# Altium project EV_Charger.PrjPcb
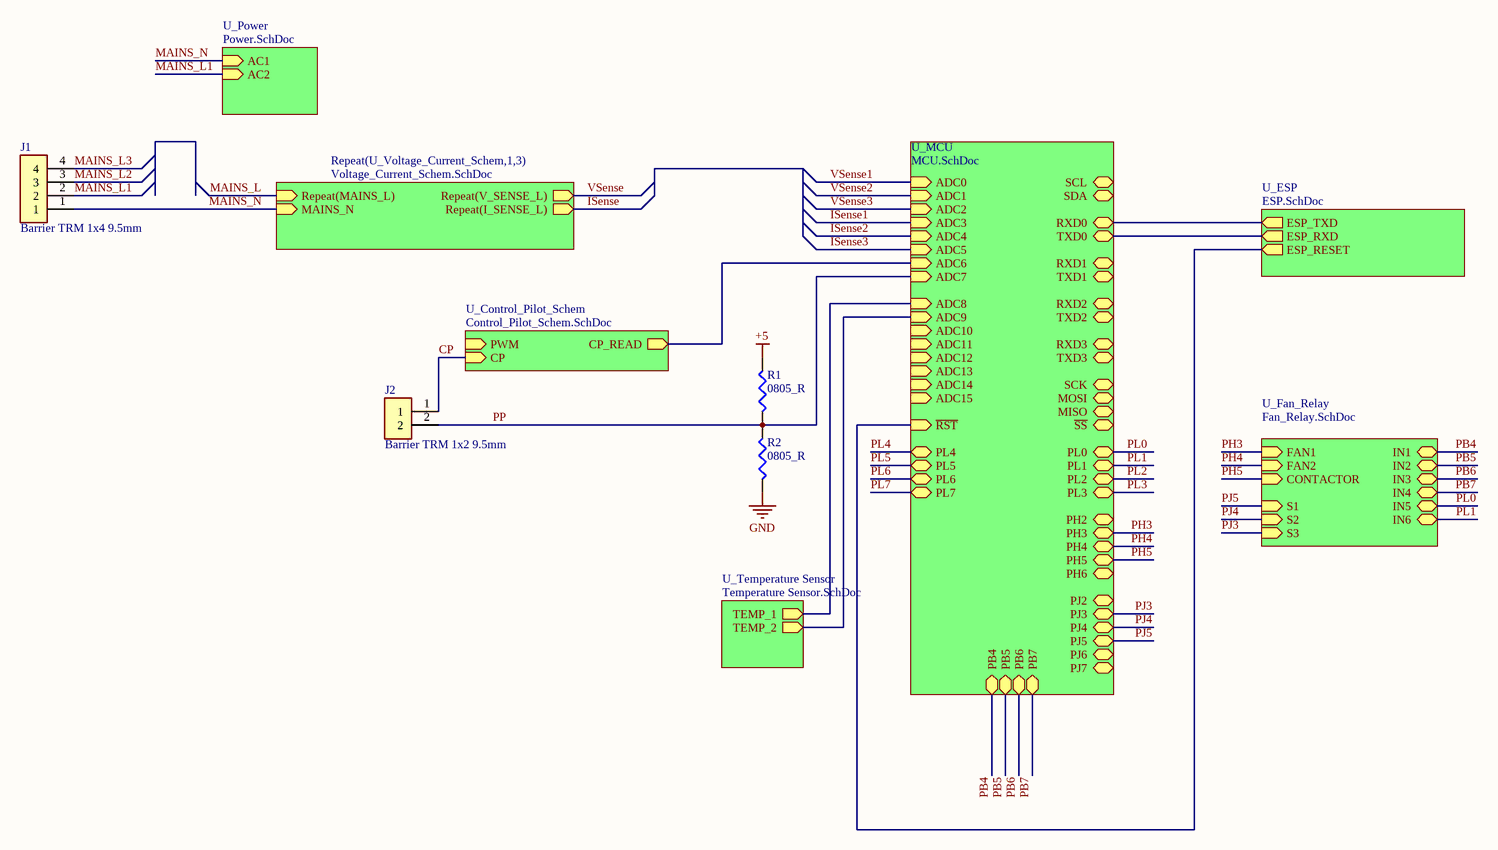
[diagram p0: EV_Schematics.SchDoc]
8 sheets, 198 parts. Net scope: hierarchical (ports join the sheet entries above them; power ports are global).
Board file: EV_PCB.PcbDoc
Sheets:
  EV_Schematics.SchDoc
    U_Control_Pilot_Schem = Control_Pilot_Schem.SchDoc
    U_ESP = ESP.SchDoc
    U_Fan_Relay = Fan_Relay.SchDoc
    U_MCU = MCU.SchDoc
    U_Power = Power.SchDoc
    U_Temperature Sensor = Temperature Sensor.SchDoc
    U_Voltage_Current_Schem1 = Voltage_Current_Schem.SchDoc
    U_Voltage_Current_Schem2 = Voltage_Current_Schem.SchDoc
    U_Voltage_Current_Schem3 = Voltage_Current_Schem.SchDoc

## Sheet EV_Schematics.SchDoc
size A3; SheetNumber: 1; SheetTotal: 8

### Parts
J1  Barrier TRM 1x4 9.5mm  [BARRIER_4_9.5mm]
J2  Barrier TRM 1x2 9.5mm  [BARRIER_9.5MM]
R1  0805_R  [R0805]
R2  0805_R  [R0805]

### Sub-sheets
Repeat(U_Voltage_Current_Schem,1,3) = Voltage_Current_Schem.SchDoc: Repeat(MAINS_L) (in), MAINS_N (in), Repeat(V_SENSE_L) (out), Repeat(I_SENSE_L) (out)
U_Control_Pilot_Schem = Control_Pilot_Schem.SchDoc: PWM (in), CP_READ (out), CP (in)
U_ESP = ESP.SchDoc: ESP_TXD (out), ESP_RXD (out), ESP_RESET (out)
U_Fan_Relay = Fan_Relay.SchDoc: FAN1 (in), FAN2 (in), S1 (in), S2 (in), S3 (in), IN1 (bidir), IN2 (bidir), IN3 (bidir), IN4 (bidir), IN5 (bidir), IN6 (bidir), CONTACTOR (in)
U_MCU = MCU.SchDoc: SCL (bidir), ADC1 (in), ADC2 (in), ADC3 (in), ADC4 (in), ADC5 (in), ADC6 (in), ADC7 (in), ADC0 (in), ~{RST} (in), SDA (bidir), RXD1 (bidir), TXD1 (bidir), RXD0 (bidir), TXD0 (bidir), ~{SS} (bidir), SCK (bidir), MOSI (bidir), MISO (bidir), ADC9 (in), ADC10 (in), ADC11 (in), ADC12 (in), ADC13 (in), ADC14 (in), ADC15 (in), ADC8 (in), RXD3 (bidir), TXD3 (bidir), RXD2 (bidir), TXD2 (bidir), PL0 (bidir), PL1 (bidir), PL2 (bidir), PL3 (bidir), PL4 (bidir), PL5 (bidir), PL6 (bidir), PL7 (bidir), PB4 (bidir), PB7 (bidir), PB5 (bidir), PB6 (bidir), PH4 (bidir), PH2 (bidir), PH5 (bidir), PH6 (bidir), PH3 (bidir), PJ4 (bidir), PJ7 (bidir), PJ5 (bidir), PJ3 (bidir), PJ2 (bidir), PJ6 (bidir)
U_Power = Power.SchDoc: AC1 (in), AC2 (in)
U_Temperature Sensor = Temperature Sensor.SchDoc: TEMP_1 (out), TEMP_2 (out)

### Nets
+5: R1.2 ; sheet U_ESP/ESP_RESET, sheet U_MCU/~{RST}  [project net ~{RST}]
GND: R2.1
ADC6: sheet U_Control_Pilot_Schem/CP_READ, sheet U_MCU/ADC6
ADC8: sheet U_MCU/ADC8, sheet U_Temperature Sensor/TEMP_1
ADC9: sheet U_MCU/ADC9, sheet U_Temperature Sensor/TEMP_2
CP: J2.1 ; sheet U_Control_Pilot_Schem/CP
ISense: sheet Repeat(U_Voltage_Current_Schem,1,3)/Repeat(I_SENSE_L)
MAINS_L: sheet Repeat(U_Voltage_Current_Schem,1,3)/Repeat(MAINS_L)
MAINS_L1: J1.2 ; sheet U_Power/AC2
MAINS_L2: J1.3
MAINS_L3: J1.4
MAINS_N: J1.1 ; sheet U_Power/AC1, sheet Repeat(U_Voltage_Current_Schem,1,3)/MAINS_N
PB4: sheet U_Fan_Relay/IN1, sheet U_MCU/PB4
PB5: sheet U_Fan_Relay/IN2, sheet U_MCU/PB5
PB6: sheet U_Fan_Relay/IN3, sheet U_MCU/PB6
PB7: sheet U_Fan_Relay/IN4, sheet U_MCU/PB7
PH3: sheet U_Fan_Relay/FAN1, sheet U_MCU/PH3
PH4: sheet U_Fan_Relay/FAN2, sheet U_MCU/PH4
PH5: sheet U_Fan_Relay/CONTACTOR, sheet U_MCU/PH5
PJ3: sheet U_Fan_Relay/S3, sheet U_MCU/PJ3
PJ4: sheet U_Fan_Relay/S2, sheet U_MCU/PJ4
PJ5: sheet U_Fan_Relay/S1, sheet U_MCU/PJ5
PL0: sheet U_Fan_Relay/IN5, sheet U_MCU/PL0
PL1: sheet U_Fan_Relay/IN6, sheet U_MCU/PL1
PP: J2.2 R1.1 R2.2 ; sheet U_MCU/ADC7  [project net ADC7]
RXD0: sheet U_ESP/ESP_TXD, sheet U_MCU/RXD0
TXD0: sheet U_ESP/ESP_RXD, sheet U_MCU/TXD0
VSense: sheet Repeat(U_Voltage_Current_Schem,1,3)/Repeat(V_SENSE_L)

### Library data of the parts
J1 = Barrier BLK_4: CONN BARRIER STRIP 4CIRC 0.374"; Manufacturer 1: On-Shore Technology; Manufacturer Part Number 1: OSTYK44102030; Current Rating: 30A; Voltage Rating: 300V; Parameter Name 1: Bulk; Number of Circuits: 2; Wire Gauge (Max): 22AWG; Wire Gauge (Min): 10AWG; Pitch: 0.374inch; Supplier 1: Digi-Key; Stock 1: 3505; Pricing 1: 1=1.22000, 10=0.76100, 25=0.65160, 50=0.58560, 100=0.57340, 250=0.48800, 500=0.46360, 1000=0.41480, 5000=0.32452 (USD); RoHS: Yes; Mount: Through Hole; Color: Black; Insulation Material: Nylon; Min Operating Temperature: -40°C; Max Operating Temperature: 105°C; Number of Rows: 1; Number of Wire Entries: 2; Flammability Rating: UL94 V-0; ComponentLink1URL: https://datasheet.ciiva.com/778/ostyk441xx030-778584.pdf?src-supplier=Digi-Key; ComponentLink1Description: https://datasheet.ciiva.com/778/ostyk441xx030-778584.pdf?src-supplier=Digi-Key; Supplier Part Number 1: ED2971-ND
J2 = Barrier BLK: CONN BARRIER STRIP 2CIRC 0.374"; Manufacturer 1: On-Shore Technology; Manufacturer Part Number 1: OSTYK44102030; Current Rating: 30A; Voltage Rating: 300V; Parameter Name 1: Bulk; Number of Circuits: 2; Wire Gauge (Max): 22AWG; Wire Gauge (Min): 10AWG; Pitch: 0.374inch; Supplier 1: Digi-Key; Stock 1: 3505; Pricing 1: 1=1.22000, 10=0.76100, 25=0.65160, 50=0.58560, 100=0.57340, 250=0.48800, 500=0.46360, 1000=0.41480, 5000=0.32452 (USD); RoHS: Yes; Mount: Through Hole; Color: Black; Insulation Material: Nylon; Min Operating Temperature: -40°C; Max Operating Temperature: 105°C; Number of Rows: 1; Number of Wire Entries: 2; Flammability Rating: UL94 V-0; ComponentLink1URL: https://datasheet.ciiva.com/778/ostyk441xx030-778584.pdf?src-supplier=Digi-Key; ComponentLink1Description: https://datasheet.ciiva.com/778/ostyk441xx030-778584.pdf?src-supplier=Digi-Key; Supplier Part Number 1: ED2971-ND
R1 R2 = 0805 Resistor

## Sheet Control_Pilot_Schem.SchDoc
size A; SheetNumber: 4; SheetTotal: 8
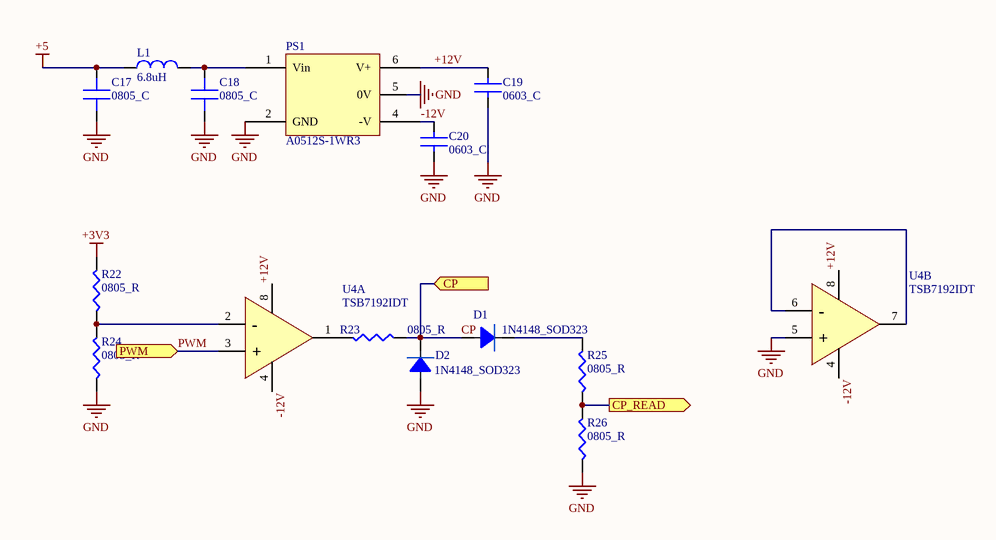
[diagram p1: Control_Pilot_Schem.SchDoc]

### Parts
C17  0805_C  [C0805 - 0.1uf]
C18  0805_C  [C0805 - 0.1uf]
C19  0603_C  [0603_CAP]
C20  0603_C  [0603_CAP]
D1  1N4148_SOD323  [SOD-323]
D2  1N4148_SOD323  [SOD-323]
L1  6.8uH  [R0805]
PS1  A0512S-1WR3  [CONV_RB-0512D/HP]
R22  0805_R  [R0805]
R23  0805_R  [R0805]
R24  0805_R  [R0805]
R25  0805_R  [R0805]
R26  0805_R  [R0805]
U4  TSB7192IDT  [SOP8]  (parts A,B of 2)

### Ports
CP (in), CP_READ (out), PWM (in)

### Nets
+3V3: R22.2
+5: C17.2 L1.1  [project net ~{RST}]
GND: C17.1 C18.1 C19.2 C20.2 D2.A(Anode) PS1.2(GND) PS1.5(0V) R24.1 R26.1 U4.5(+)
+12V: C19.1 PS1.6(V+) U4.8(VCC)
-12V: C20.1 PS1.4(-V) U4.4(VSS)
ADC6: R25.1 R26.2 ; port CP_READ
CP: D1.A(Anode) D2.K(Cathode) R23.1 ; port CP
PWM: U4.3(+) ; port PWM
NetC18_2: C18.2 L1.2 PS1.1(Vin)
NetD1_K: D1.K(Cathode) R25.2
NetR22_1: R22.1 R24.2 U4.2(-)
NetR23_2: R23.2 U4.1(OUT1)
NetU4_6: U4.6(-) U4.7(OUT1)

### Library data of the parts
C17 C18 = 0805 Capacitor
C19 C20 = 0603 Capacitor
D1 D2 = 1N4148WS: DIODE GEN PURP 100V 300MA SOD123; Reverse Recovery Time: 4ns; Forward Voltage: 1.25V; Element Configuration: Single; Forward Current: 150mA; Peak Non-Repetitive Surge Current: 2A; Max Reverse Current: 1uA; Power Dissipation: 400mW; Polarity: Standard; Capacitance: 2pF; Voltage Rating (DC): 75V; Supplier 1: Digi-Key; Stock 1: 0; Pricing 1: 1=0.18000, 10=0.16800, 100=0.09120, 500=0.05614, 1000=0.03828 (USD); RoHS: Yes; Mount: Surface Mount; Number of Pins: 2; Weight: 0.000353oz; Contact Plating: Tin,Matte; Min Operating Temperature: -65°C; Max Operating Temperature: 150°C; Packaging: Tape and Reel; Max Repetitive Reverse Voltage (Vrrm): 100V; Average Rectified Current: 300mA; Max Reverse Voltage (DC): 100V; Package Quantity: 3000; Recovery Time: 4ns; Max Forward Surge Current (Ifsm): 2A; Current Rating: 150mA; Max Surge Current: 2A; Output Current: 150mA; Series: -; Voltage: 100V; Reverse Recovery Time-Max: 4ns; Power Rating: 400mW; Length: 2.85mm; Width: 1.7mm; Height: 1.25mm; Radiation Hardening: No; Lead Free: Lead Free; RoHS Compliant: Yes; REACH SVHC: No SVHC; ComponentLink1URL: https://datasheet.ciiva.com/911/ds30086-911734.pdf?src-supplier=Digi-Key; ComponentLink1Description: https://datasheet.ciiva.com/911/ds30086-911734.pdf?src-supplier=Digi-Key; ComponentLink2URL: https://datasheet.ciiva.com/911/ds30086-911735.pdf?src-supplier=Digi-Key; ComponentLink2Description: https://datasheet.ciiva.com/911/ds30086-911735.pdf?src-supplier=Digi-Key; ComponentLink3URL: https://datasheet.ciiva.com/22695/1915529-22695239.pdf?src-supplier=Element14; ComponentLink3Description: https://datasheet.ciiva.com/22695/1915529-22695239.pdf?src-supplier=Element14; ComponentLink4URL: https://datasheet.ciiva.com/911/ds30086-911736.pdf?src-supplier=Digi-Key; ComponentLink4Description: https://datasheet.ciiva.com/911/ds30086-911736.pdf?src-supplier=Digi-Key; ComponentLink5URL: https://datasheet.ciiva.com/1179/1915529-1179304.pdf?src-supplier=Element14; ComponentLink5Description: https://datasheet.ciiva.com/1179/1915529-1179304.pdf?src-supplier=Element14; ComponentLink6URL: https://datasheet.ciiva.com/4435/ds30086-4435128.pdf?src-supplier=Mouser; ComponentLink6Description: https://datasheet.ciiva.com/4435/ds30086-4435128.pdf?src-supplier=Mouser; ComponentLink7URL: https://datasheet.ciiva.com/8300/ds30086-8300392.pdf?src-supplier=Avnet; ComponentLink7Description: https://datasheet.ciiva.com/8300/ds30086-8300392.pdf?src-supplier=Avnet; ComponentLink8URL: https://datasheet.ciiva.com/25919/ds30086-25919609.pdf?src-supplier=Avnet+Europe; ComponentLink8Description: https://datasheet.ciiva.com/25919/ds30086-25919609.pdf?src-supplier=Avnet+Europe; ComponentLink9URL: https://datasheet.ciiva.com/15219/getdatasheetpartid-110030-15219548.pdf?src-supplier=Verical; ComponentLink9Description: https://datasheet.ciiva.com/15219/getdatasheetpartid-110030-15219548.pdf?src-supplier=Verical; ComponentLink10URL: https://datasheet.ciiva.com/8303/ds30086-8303197.pdf?src-supplier=Avnet; ComponentLink10Description: https://datasheet.ciiva.com/8303/ds30086-8303197.pdf?src-supplier=Avnet
L1 = ILSB1206ER100K: 6.8uH 0805 Inductor; Manufacturer 1: Vishay Dale; Core Material: Ferrite; Current Rating: 25mA; Tolerance: 10%; Shielding: Shielded; Self Resonant Frequency: 28MHz; Q Factor: 45; Inductance: 10uH; DC Resistance (DCR): 1R; Test Frequency: 2MHz; Supplier 1: Mouser; Stock 1: 11113; Pricing 1: 1=0.23, 10=0.204, 50=0.204, 100=0.137, 1000=0.096, 10000=0.072 (USD); RoHS: Yes; Mount: Surface Mount; Case/Package: 1206; Case Code (Metric): 3216; Case Code (Imperial): 1206; Min Operating Temperature: -55°C; Max Operating Temperature: 125°C; Package Quantity: 3000; Packaging: Tape and Reel; Inductance Tolerance: 10%; Max DC Current: 25mA; Termination: SMD/SMT; DC Current: 25mA; Series: ILSB-1206; Rated Current-Max: 25mA; Length: 0.126inch; Width: 0.063inch; Height: 0.02inch; Height - Seated (Max): 0.055inch; Depth: 1.8mm; Radiation Hardening: No; Military Standard: Not; Lead Free: Lead Free; RoHS Compliant: Yes; Reach SVHC Compliant: Unknown; ComponentLink1URL: https://datasheet.ciiva.com/1067/ilsb1206-1067856.pdf?src-supplier=Digi-Key; ComponentLink1Description: https://datasheet.ciiva.com/1067/ilsb1206-1067856.pdf?src-supplier=Digi-Key; ComponentLink2URL: https://datasheet.ciiva.com/7243/1537078-7243341.pdf?src-supplier=Newark; ComponentLink2Description: https://datasheet.ciiva.com/7243/1537078-7243341.pdf?src-supplier=Newark; ComponentLink3URL: https://datasheet.ciiva.com/3867/ilsb1206-3867119.pdf?src-supplier=Arrow+Electronics; ComponentLink3Description: https://datasheet.ciiva.com/3867/ilsb1206-3867119.pdf?src-supplier=Arrow+Electronics; Supplier Part Number 1: 70-ILSB1206ER100K; Manufacturer Part Number 1: ILSB1206ER100K
R22-R26 = 0805 Resistor
U4 = TSB7192IDT: 22MHz 300nA Dual channel SOIC-8 Precision Op Amps ROHS

## Sheet ESP.SchDoc
size A; SheetNumber: 6; SheetTotal: 8
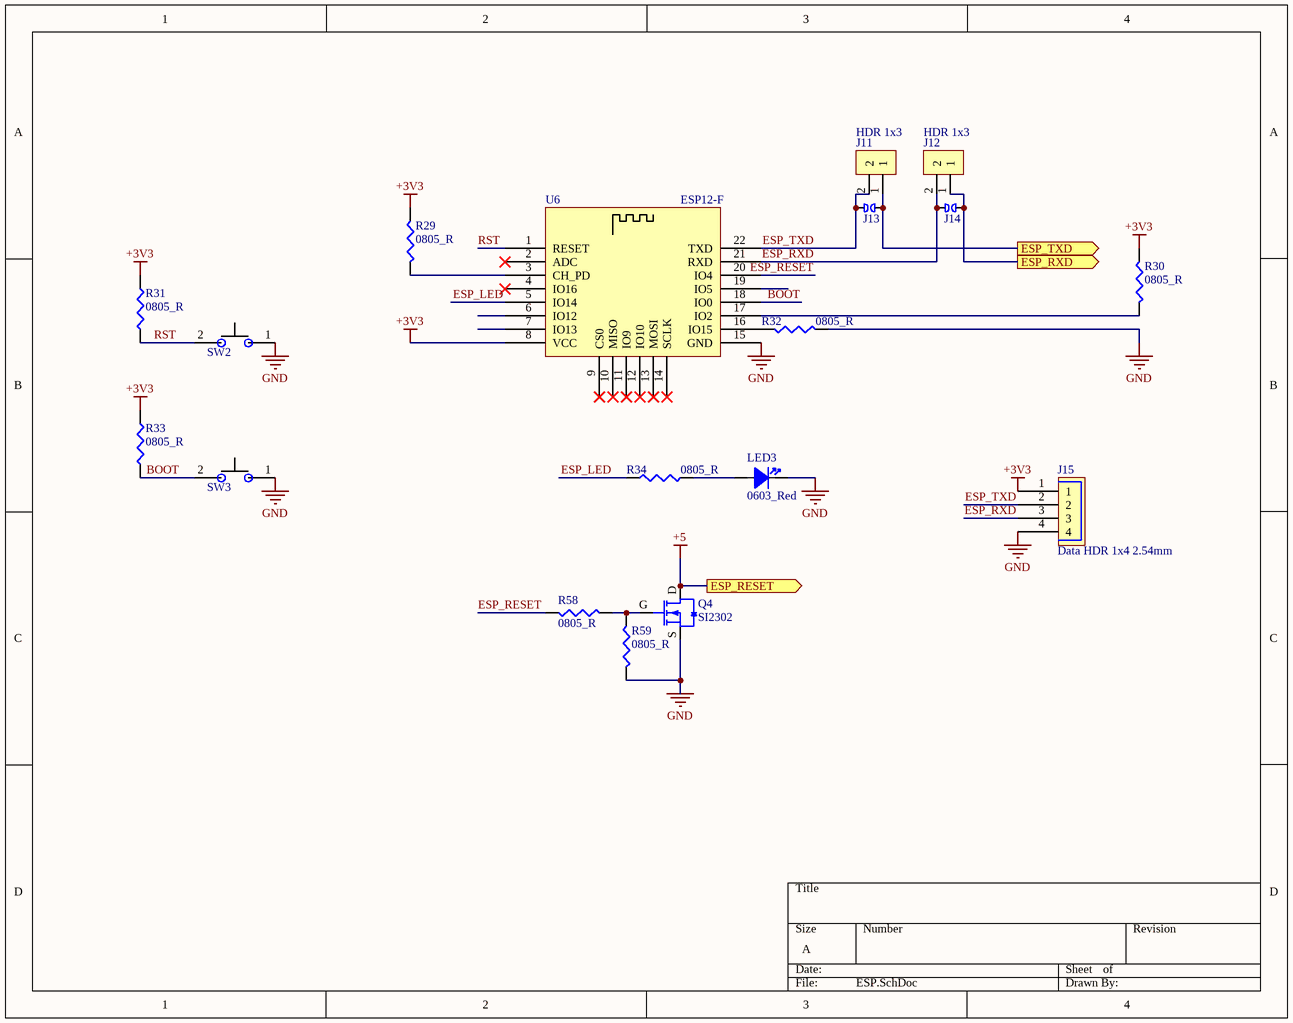
[diagram p2: ESP.SchDoc]

### Parts
J11  HDR 1x3  [HDR 1x2 2.54mm]
J12  HDR 1x3  [HDR 1x2 2.54mm]
J13  Jumper Pads  [JMP]  (value not drawn)
J14  Jumper Pads  [JMP]  (value not drawn)
J15  Data HDR 1x4 2.54mm  [DHDR_1x4_2.54mm]
LED3  0603_Red  [0603_LED]
Q4  SI2302  [SO-23 - MOSFET]
R29  0805_R  [R0805]
R30  0805_R  [R0805]
R31  0805_R  [R0805]
R32  0805_R  [R0805]
R33  0805_R  [R0805]
R34  0805_R  [R0805]
R58  0805_R  [R0805]
R59  0805_R  [R0805]
SW2  2*3*4 SMD Button 2_Pads  [2padSMD- 2*3*4]  (value not drawn)
SW3  2*3*4 SMD Button 2_Pads  [2padSMD- 2*3*4]  (value not drawn)
U6  ESP12-F  [ESP12-F]

### Ports
ESP_RESET (out), ESP_RXD (out), ESP_TXD (out)

### Nets
+3V3: J15.1 R29.2 R30.2 R31.2 R33.2 U6.8(VCC)
+5: Q4.D ; port ESP_RESET  [project net ~{RST}]
GND: J15.4 LED3.2(Cathode) Q4.S R32.1 R59.1 SW2.1 SW3.1 U6.15(GND)
BOOT: R33.1 SW3.2 U6.18(IO0)
ESP_LED: R34.1 U6.5(IO14)
ESP_RESET: R58.1 U6.20(IO4)
ESP_RXD: J12.2 J14.1 J15.3 U6.21(RXD)
ESP_TXD: J11.2 J13.1 J15.2 U6.22(TXD)
RST: R31.1 SW2.2 U6.1(RESET)
RXD0: J11.1 J13.2 ; port ESP_TXD
TXD0: J12.1 J14.2 ; port ESP_RXD
NetLED3_1: LED3.1(Anode) R34.2
NetQ4_G: Q4.G R58.2 R59.2
NetR29_1: R29.1 U6.3(CH_PD)
NetR30_1: R30.1 U6.17(IO2)
NetR32_2: R32.2 U6.16(IO15)

Not connected (* = marked no-connect by the designer): U6 2(ADC)* 4(IO16)* 6(IO12) 7(IO13) 9(CS0)* 10(MISO)* 11(IO9)* 12(IO10)* 13(MOSI)* 14(SCLK)* 19(IO5)

### Library data of the parts
J11 J12 = HDR 1x2: 1x3 Male Header 2.54 mm pitch
J15 = 4-Pin Data Connector: MTA-100 Series, 2.54mm Pitch 4 Way 1 RowStraight PCB Header, Solder Term, 5A; Manufacturer 1: TE Connectivity; Manufacturer Part Number 1: 2-644861-4; Underplate Material: Nickel; Number of Contacts: 4; Connector Type: Plug,Header,Pin; Voltage Rating: 250V; Gender: Male; Shrouded: Yes (With); PCB Mount Retention: Without; PCB Mounting Orientation: Vertical; Contact Resistance: 6mR; Backwall/Post Interruptions: No (Without); Connector System: Wire-to-Board; Contact Post Length: 3.56mm; Plating Thickness: 6.35um; PCB Thickness: 0.063inch; Approvals: CSA; Supplier 1: Digi-Key; Stock 1: 18767; Pricing 1: 1=0.79000, 10=0.74100, 100=0.56790, 500=0.49380, 1000=0.40739, 5000=0.35801, 10000=0.33332 (USD); RoHS: Yes; Mount: Through Hole; Housing Color: Black; Color: Black; Contact Material: Copper Alloy; Contact Plating: Tin,Matte; Housing Material: Polyester; Contact Shape: Square; Min Operating Temperature: -67°C; Max Operating Temperature: 221°C; Termination: Solder; Number of Rows: 1; Contact Gender: Male; Number of Positions: 4; Package Quantity: 500; Packaging: Loose Piece; Current Rating: 5A; Voltage Rating (AC): 250V; Mating Alignment: Yes (With); Orientation: Straight; Fastening Type: Friction; Max Voltage Rating (AC): 250V; Contact Current Rating: 5A; Contact Retention: No (Without); Mating Retention: Yes (With); PCB Mount Alignment: No (Without); Sealable: No (Without); Strain Relief: No (Without); Contact Style: Straight; Length: 12.29mm; Height: 10.41mm; Pitch: 2.54mm; Contact Mating Length: 5.1mm; Depth: 7.95mm; Tail Length: 3.56mm; Radiation Hardening: No; Flammability Rating: UL94 V-0; ELV: Compliant; Lead Free: Lead Free; REACH SVHC: Unknown; ComponentLink1URL: https://datasheet.ciiva.com/7800/1651878-7800290.pdf?src-supplier=Element14; ComponentLink1Description: https://datasheet.ciiva.com/7800/1651878-7800290.pdf?src-supplier=Element14; ComponentLink2URL: https://datasheet.ciiva.com/15175/getdatasheetpartid-36841-15175492.pdf?src-supplier=Verical; ComponentLink2Description: https://datasheet.ciiva.com/15175/getdatasheetpartid-36841-15175492.pdf?src-supplier=Verical; ComponentLink3URL: https://datasheet.ciiva.com/11759/0900766b80f915a0-11759930.pdf?src-supplier=RSComponents; ComponentLink3Description: https://datasheet.ciiva.com/11759/0900766b80f915a0-11759930.pdf?src-supplier=RSComponents; ComponentLink4URL: https://datasheet.ciiva.com/714/eng-cd-644861-n-basefilename-714593.pdf?src-supplier=Digi-Key; ComponentLink4Description: https://datasheet.ciiva.com/714/eng-cd-644861-n-basefilename-714593.pdf?src-supplier=Digi-Key; ComponentLink5URL: https://datasheet.ciiva.com/16684/eng-ds-82056-mta-0608-16684709.pdf?src-supplier=Avnet+Europe; ComponentLink5Description: https://datasheet.ciiva.com/16684/eng-ds-82056-mta-0608-16684709.pdf?src-supplier=Avnet+Europe; ComponentLink6URL: https://datasheet.ciiva.com/16497/eng-ds-82056-mta-0608-16497871.pdf?src-supplier=Avnet+Asia; ComponentLink6Description: https://datasheet.ciiva.com/16497/eng-ds-82056-mta-0608-16497871.pdf?src-supplier=Avnet+Asia; Supplier Part Number 1: A30933-ND
LED3 = 0603LED
Q4 = SI2302: SI2302 A2SHB 20V 2.5A 0.9W 40mΩ@4.5V,2.5A N Channel SOT-23 MOSFET SMD
R29-R34 R58 R59 = 0805 Resistor

## Sheet Fan_Relay.SchDoc
size A; SheetNumber: 8; SheetTotal: 8
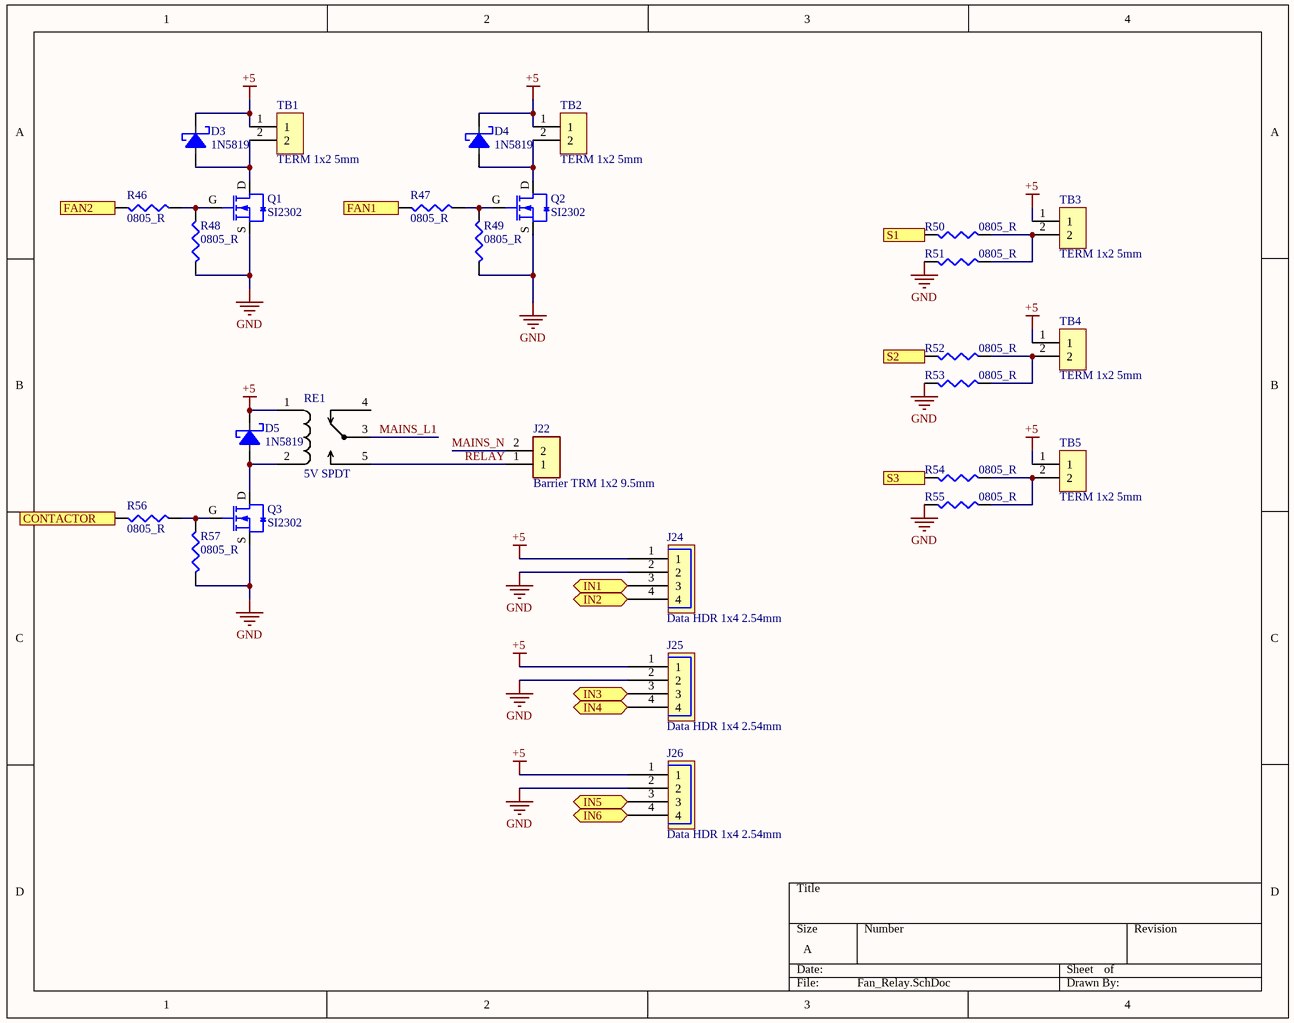
[diagram p3: Fan_Relay.SchDoc]

### Parts
D3  1N5819  [D0-214AC]
D4  1N5819  [D0-214AC]
D5  1N5819  [D0-214AC]
J22  Barrier TRM 1x2 9.5mm  [BARRIER_9.5MM]
J24  Data HDR 1x4 2.54mm  [DHDR_1x4_2.54mm]
J25  Data HDR 1x4 2.54mm  [DHDR_1x4_2.54mm]
J26  Data HDR 1x4 2.54mm  [DHDR_1x4_2.54mm]
Q1  SI2302  [SO-23 - MOSFET]
Q2  SI2302  [SO-23 - MOSFET]
Q3  SI2302  [SO-23 - MOSFET]
R46  0805_R  [R0805]
R47  0805_R  [R0805]
R48  0805_R  [R0805]
R49  0805_R  [R0805]
R50  0805_R  [R0805]
R51  0805_R  [R0805]
R52  0805_R  [R0805]
R53  0805_R  [R0805]
R54  0805_R  [R0805]
R55  0805_R  [R0805]
R56  0805_R  [R0805]
R57  0805_R  [R0805]
RE1  5V SPDT  [12mm_relay_spdt]
TB1  TERM 1x2 5mm  [Terminal_5mm]
TB2  TERM 1x2 5mm  [Terminal_5mm]
TB3  TERM 1x2 5mm  [Terminal_5mm]
TB4  TERM 1x2 5mm  [Terminal_5mm]
TB5  TERM 1x2 5mm  [Terminal_5mm]

### Ports
CONTACTOR (in), FAN1 (in), FAN2 (in), IN1 (bidir), IN2 (bidir), IN3 (bidir), IN4 (bidir), IN5 (bidir), IN6 (bidir), S1 (in), S2 (in), S3 (in)

### Nets
+5: D3.K(Cathode) D4.K(Cathode) D5.K(Cathode) J24.1 J25.1 J26.1 RE1.1 TB1.1 TB2.1 TB3.1 TB4.1 TB5.1  [project net ~{RST}]
GND: J24.2 J25.2 J26.2 Q1.S Q2.S Q3.S R48.1 R49.1 R51.2 R53.2 R55.2 R57.1
MAINS_L1: RE1.3
MAINS_N: J22.2
PB4: J24.3 ; port IN1
PB5: J24.4 ; port IN2
PB6: J25.3 ; port IN3
PB7: J25.4 ; port IN4
PH3: R47.1 ; port FAN1
PH4: R46.1 ; port FAN2
PH5: R56.1 ; port CONTACTOR
PJ3: R54.2 ; port S3
PJ4: R52.2 ; port S2
PJ5: R50.2 ; port S1
PL0: J26.3 ; port IN5
PL1: J26.4 ; port IN6
RELAY: J22.1 RE1.5
NetD3_A: D3.A(Anode) Q1.D TB1.2
NetD4_A: D4.A(Anode) Q2.D TB2.2
NetD5_A: D5.A(Anode) Q3.D RE1.2
NetQ1_G: Q1.G R46.2 R48.2
NetQ2_G: Q2.G R47.2 R49.2
NetQ3_G: Q3.G R56.2 R57.2
NetR50_1: R50.1 R51.1 TB3.2
NetR52_1: R52.1 R53.1 TB4.2
NetR54_1: R54.1 R55.1 TB5.2

Not connected (* = marked no-connect by the designer): RE1 4

### Library data of the parts
D3-D5 = 1N5819: 1N5819 SS14 SMA Schottky Barrier Diodes (SBD) 40V 550mV@1A 1A
J22 = Barrier BLK: as J2 on sheet EV_Schematics; Supplier 1: Digi-Key; Stock 1: 3505; Pricing 1: 1=1.22000, 10=0.76100, 25=0.65160, 50=0.58560, 100=0.57340, 250=0.48800, 500=0.46360, 1000=0.41480, 5000=0.32452 (USD); RoHS: Yes; Mount: Through Hole; Color: Black; Insulation Material: Nylon; Min Operating Temperature: -40°C; Max Operating Temperature: 105°C; Number of Rows: 1; Number of Wire Entries: 2; Flammability Rating: UL94 V-0; ComponentLink1URL: https://datasheet.ciiva.com/778/ostyk441xx030-778584.pdf?src-supplier=Digi-Key; ComponentLink1Description: https://datasheet.ciiva.com/778/ostyk441xx030-778584.pdf?src-supplier=Digi-Key; Supplier Part Number 1: ED2971-ND
J24-J26 = 4-Pin Data Connector: as J15 on sheet ESP; Supplier 1: Digi-Key; Stock 1: 18767; Pricing 1: 1=0.79000, 10=0.74100, 100=0.56790, 500=0.49380, 1000=0.40739, 5000=0.35801, 10000=0.33332 (USD); RoHS: Yes; Mount: Through Hole; Housing Color: Black; Color: Black; Contact Material: Copper Alloy; Contact Plating: Tin,Matte; Housing Material: Polyester; Contact Shape: Square; Min Operating Temperature: -67°C; Max Operating Temperature: 221°C; Termination: Solder; Number of Rows: 1; Contact Gender: Male; Number of Positions: 4; Package Quantity: 500; Packaging: Loose Piece; Current Rating: 5A; Voltage Rating (AC): 250V; Mating Alignment: Yes (With); Orientation: Straight; Fastening Type: Friction; Max Voltage Rating (AC): 250V; Contact Current Rating: 5A; Contact Retention: No (Without); Mating Retention: Yes (With); PCB Mount Alignment: No (Without); Sealable: No (Without); Strain Relief: No (Without); Contact Style: Straight; Length: 12.29mm; Height: 10.41mm; Pitch: 2.54mm; Contact Mating Length: 5.1mm; Depth: 7.95mm; Tail Length: 3.56mm; Radiation Hardening: No; Flammability Rating: UL94 V-0; ELV: Compliant; Lead Free: Lead Free; REACH SVHC: Unknown; ComponentLink1URL: https://datasheet.ciiva.com/7800/1651878-7800290.pdf?src-supplier=Element14; ComponentLink1Description: https://datasheet.ciiva.com/7800/1651878-7800290.pdf?src-supplier=Element14; ComponentLink2URL: https://datasheet.ciiva.com/15175/getdatasheetpartid-36841-15175492.pdf?src-supplier=Verical; ComponentLink2Description: https://datasheet.ciiva.com/15175/getdatasheetpartid-36841-15175492.pdf?src-supplier=Verical; ComponentLink3URL: https://datasheet.ciiva.com/11759/0900766b80f915a0-11759930.pdf?src-supplier=RSComponents; ComponentLink3Description: https://datasheet.ciiva.com/11759/0900766b80f915a0-11759930.pdf?src-supplier=RSComponents; ComponentLink4URL: https://datasheet.ciiva.com/714/eng-cd-644861-n-basefilename-714593.pdf?src-supplier=Digi-Key; ComponentLink4Description: https://datasheet.ciiva.com/714/eng-cd-644861-n-basefilename-714593.pdf?src-supplier=Digi-Key; ComponentLink5URL: https://datasheet.ciiva.com/16684/eng-ds-82056-mta-0608-16684709.pdf?src-supplier=Avnet+Europe; ComponentLink5Description: https://datasheet.ciiva.com/16684/eng-ds-82056-mta-0608-16684709.pdf?src-supplier=Avnet+Europe; ComponentLink6URL: https://datasheet.ciiva.com/16497/eng-ds-82056-mta-0608-16497871.pdf?src-supplier=Avnet+Asia; ComponentLink6Description: https://datasheet.ciiva.com/16497/eng-ds-82056-mta-0608-16497871.pdf?src-supplier=Avnet+Asia; Supplier Part Number 1: A30933-ND
Q1-Q3 = SI2302: as Q4 on sheet ESP
R46-R57 = 0805 Resistor
RE1 = 5V Relay
TB1-TB5 = Terminal BLK Green: PHOENIX CONTACT         MKDSN 1,5/ 2             Wire-To-Board Terminal Block, 5 mm, 2 Ways, 26 AWG, 16 AWG, 1.5 mm, Screw; Manufacturer Part Number 1: 1729018; Parameter Name 1: Bulk; Number of Positions: 2; Current Rating: 13.5A; Number of Levels: 1; Current: 10A; Gender: Male; Voltage Rating: 400V; Voltage: 300V; Max Supply Voltage: 250V; Wire Gauge (Max): 26AWG; Stripping Length: 6mm; Approvals: UL,CSA,cULus,CB; Supplier 1: Mouser; Manufacturer 1: Phoenix Contact; Stock 1: 6371; Pricing 1: 1=1.10000, 10=1.05000, 50=1.01000, 100=0.97400, 250=0.91000, 500=0.83800 (USD); RoHS: Yes; Mount: Through Hole; Number of Pins: 2; Weight: 0.06949oz; Color: Green; Material: Polyamide; Housing Material: Polyamide; Housing Color: Green; Contact Material: Tin; Insulation Material: Nylon; Package Quantity: 50; Termination: Screw; Number of Positions Per Level: 2; Number of Contacts: 2; Number of Circuits: 2; Connector Type: Screw; Orientation: Straight; Number of Rows: 1; Max Current Rating: 13.5A; Number of Poles: 2; Length: 8.1mm; Height: 13.5mm; Pitch: 5mm; Wire Gauge (Min): 26AWG; Depth: 8.1mm; Width: 13.5mm; Wire/Cable Gauge: 26AWG; Radiation Hardening: No; REACH SVHC: Unknown; Flammability Rating: UL94 V-0; Lead Free: Lead Free; ComponentLink1URL: https://datasheet.ciiva.com/16071/1729018-16071814.pdf?src-supplier=Onlinecomponents.com; ComponentLink1Description: https://datasheet.ciiva.com/16071/1729018-16071814.pdf?src-supplier=Onlinecomponents.com; ComponentLink2URL: https://datasheet.ciiva.com/832/1729018-832055.pdf?src-supplier=Digi-Key; ComponentLink2Description: https://datasheet.ciiva.com/832/1729018-832055.pdf?src-supplier=Digi-Key; ComponentLink3URL: https://datasheet.ciiva.com/15169/getdatasheetpartid-177860-15169643.pdf?src-supplier=Verical; ComponentLink3Description: https://datasheet.ciiva.com/15169/getdatasheetpartid-177860-15169643.pdf?src-supplier=Verical; ComponentLink4URL: https://datasheet.ciiva.com/14607/70054375-14607356.pdf?src-supplier=Allied+Electronics; ComponentLink4Description: https://datasheet.ciiva.com/14607/70054375-14607356.pdf?src-supplier=Allied+Electronics; ComponentLink5URL: https://datasheet.ciiva.com/33105/1729018-33105978.pdf?src-supplier=Today+Components; ComponentLink5Description: https://datasheet.ciiva.com/33105/1729018-33105978.pdf?src-supplier=Today+Components; Supplier Part Number 1: 651-1729018

## Sheet MCU.SchDoc
size A4; SheetNumber: 2; SheetTotal: 8
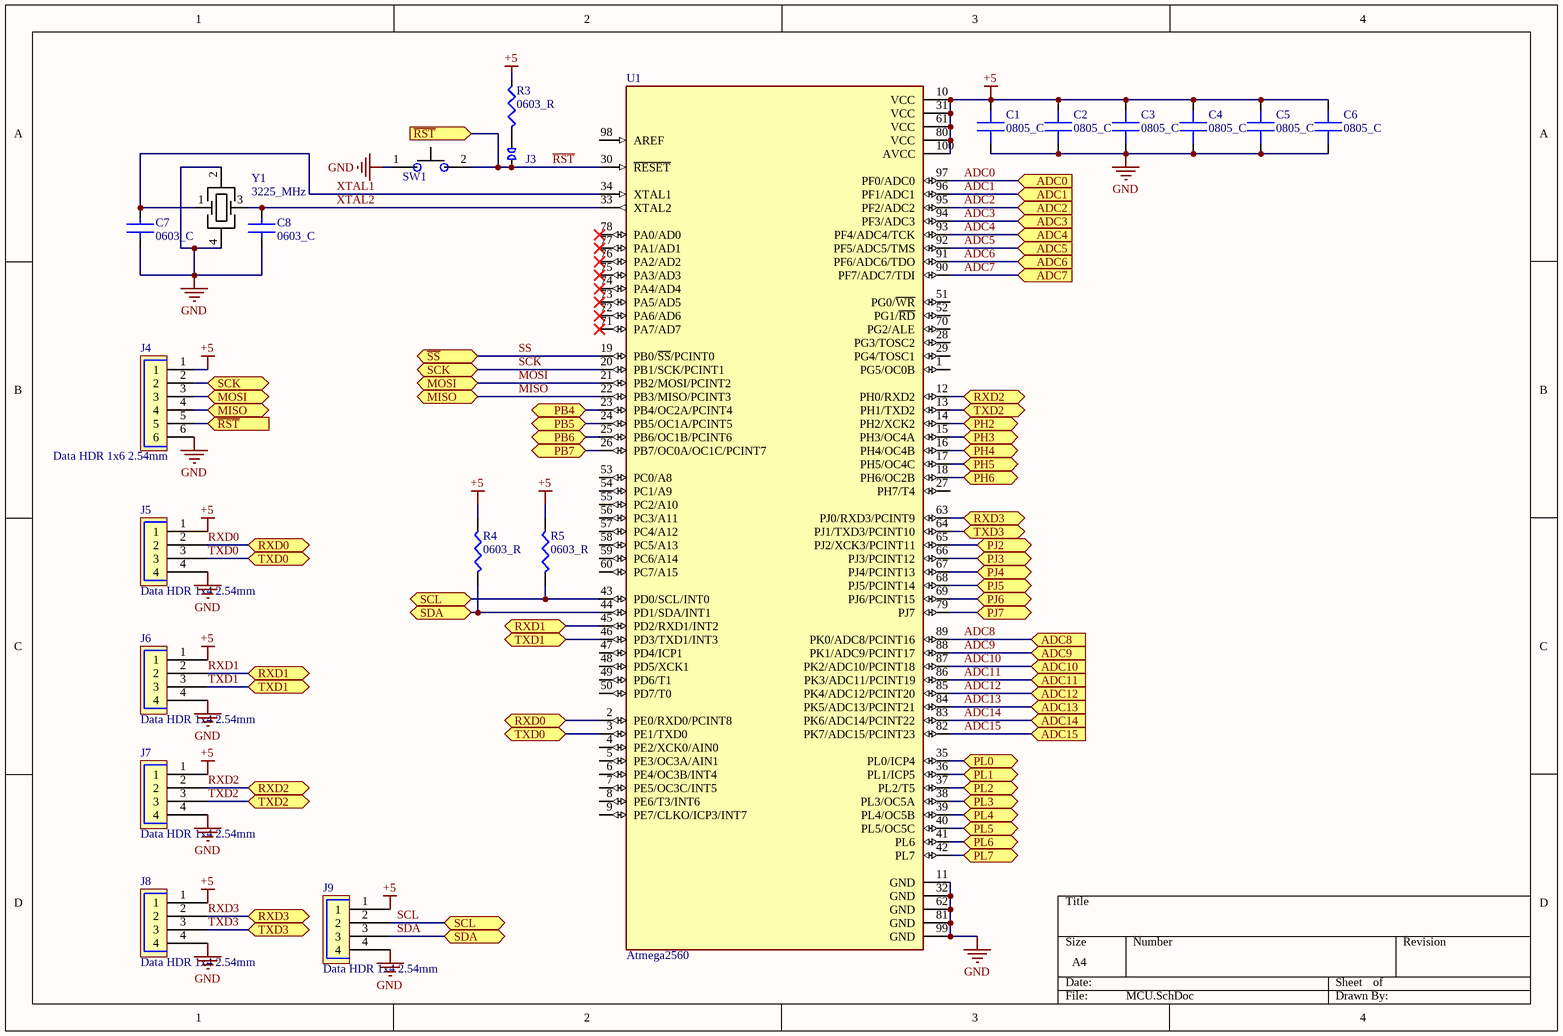
[diagram p4: MCU.SchDoc]

### Parts
C1  0805_C  [C0805 - 0.1uf]
C2  0805_C  [C0805 - 0.1uf]
C3  0805_C  [C0805 - 0.1uf]
C4  0805_C  [C0805 - 0.1uf]
C5  0805_C  [C0805 - 0.1uf]
C6  0805_C  [C0805 - 0.1uf]
C7  0603_C  [0603_CAP]
C8  0603_C  [0603_CAP]
J3  Jumper Pads  [JMP]  (value not drawn)
J4  Data HDR 1x6 2.54mm  [DHDR_1x6_2.54mm]
J5  Data HDR 1x4 2.54mm  [DHDR_1x4_2.54mm]
J6  Data HDR 1x4 2.54mm  [DHDR_1x4_2.54mm]
J7  Data HDR 1x4 2.54mm  [DHDR_1x4_2.54mm]
J8  Data HDR 1x4 2.54mm  [DHDR_1x4_2.54mm]
J9  Data HDR 1x4 2.54mm  [DHDR_1x4_2.54mm]
R3  0603_R  [0603_CAP]
R4  0603_R  [0603_CAP]
R5  0603_R  [0603_CAP]
SW1  2*3*4 SMD Button 2_Pads  [2padSMD- 2*3*4]  (value not drawn)
U1  Atmega2560  [QFP50P1600X1600X120-100N]
Y1  3225_MHz  [3225_Crystal]

### Ports
ADC0 (in), ADC1 (in), ADC2 (in), ADC3 (in), ADC4 (in), ADC5 (in), ADC6 (in), ADC7 (in), ADC8 (in), ADC9 (in), ADC10 (in), ADC11 (in), ADC12 (in), ADC13 (in), ADC14 (in), ADC15 (in), MISO (bidir), MOSI (bidir), PB4 (bidir), PB5 (bidir), PB6 (bidir), PB7 (bidir), PH2 (bidir), PH3 (bidir), PH4 (bidir), PH5 (bidir), PH6 (bidir), PJ2 (bidir), PJ3 (bidir), PJ4 (bidir), PJ5 (bidir), PJ6 (bidir), PJ7 (bidir), PL0 (bidir), PL1 (bidir), PL2 (bidir), PL3 (bidir), PL4 (bidir), PL5 (bidir), PL6 (bidir), PL7 (bidir), RXD0 (bidir), RXD1 (bidir), RXD2 (bidir), RXD3 (bidir), SCK (bidir), SCL (bidir), SDA (bidir), TXD0 (bidir), TXD1 (bidir), TXD2 (bidir), TXD3 (bidir), ~{RST} (in), ~{SS} (bidir)

### Nets
GND: C1.1 C2.1 C3.1 C4.1 C5.1 C6.1 C7.1 C8.1 J4.6 J5.4 J6.4 J7.4 J8.4 J9.4 SW1.1 U1.11(GND) U1.32(GND) U1.62(GND) U1.81(GND) U1.99(GND) Y1.2 Y1.4
~{RST}: C1.2 C2.2 C3.2 C4.2 C5.2 C6.2 J3.1 J4.1 J4.5 J5.1 J6.1 J7.1 J8.1 J9.1 R3.2 R4.2 R5.2 SW1.2 U1.10(VCC) U1.30(~{RESET}) U1.31(VCC) U1.61(VCC) U1.80(VCC) U1.100(AVCC) ; port ~{RST}  [also labelled +5]
ADC0: U1.97(PF0/ADC0) ; port ADC0
ADC1: U1.96(PF1/ADC1) ; port ADC1
ADC2: U1.95(PF2/ADC2) ; port ADC2
ADC3: U1.94(PF3/ADC3) ; port ADC3
ADC4: U1.93(PF4/ADC4/TCK) ; port ADC4
ADC5: U1.92(PF5/ADC5/TMS) ; port ADC5
ADC6: U1.91(PF6/ADC6/TDO) ; port ADC6
ADC7: U1.90(PF7/ADC7/TDI) ; port ADC7
ADC8: U1.89(PK0/ADC8/PCINT16) ; port ADC8
ADC9: U1.88(PK1/ADC9/PCINT17) ; port ADC9
ADC10: U1.87(PK2/ADC10/PCINT18) ; port ADC10
ADC11: U1.86(PK3/ADC11/PCINT19) ; port ADC11
ADC12: U1.85(PK4/ADC12/PCINT20) ; port ADC12
ADC13: U1.84(PK5/ADC13/PCINT21) ; port ADC13
ADC14: U1.83(PK6/ADC14/PCINT22) ; port ADC14
ADC15: U1.82(PK7/ADC15/PCINT23) ; port ADC15
MISO: J4.4 U1.22(PB3/MISO/PCINT3) ; port MISO
MOSI: J4.3 U1.21(PB2/MOSI/PCINT2) ; port MOSI
PB4: U1.23(PB4/OC2A/PCINT4) ; port PB4
PB5: U1.24(PB5/OC1A/PCINT5) ; port PB5
PB6: U1.25(PB6/OC1B/PCINT6) ; port PB6
PB7: U1.26(PB7/OC0A/OC1C/PCINT7) ; port PB7
PH3: U1.15(PH3/OC4A) ; port PH3
PH4: U1.16(PH4/OC4B) ; port PH4
PH5: U1.17(PH5/OC4C) ; port PH5
PJ3: U1.66(PJ3/PCINT12) ; port PJ3
PJ4: U1.67(PJ4/PCINT13) ; port PJ4
PJ5: U1.68(PJ5/PCINT14) ; port PJ5
PL0: U1.35(PL0/ICP4) ; port PL0
PL1: U1.36(PL1/ICP5) ; port PL1
PL2: U1.37(PL2/T5) ; port PL2
PL3: U1.38(PL3/OC5A) ; port PL3
PL4: U1.39(PL4/OC5B) ; port PL4
PL5: U1.40(PL5/OC5C) ; port PL5
PL6: U1.41(PL6) ; port PL6
PL7: U1.42(PL7) ; port PL7
RXD0: J5.2 U1.2(PE0/RXD0/PCINT8) ; port RXD0
RXD1: J6.2 U1.45(PD2/RXD1/INT2) ; port RXD1
RXD2: J7.2 U1.12(PH0/RXD2) ; port RXD2
RXD3: J8.2 U1.63(PJ0/RXD3/PCINT9) ; port RXD3
SCK: J4.2 U1.20(PB1/SCK/PCINT1) ; port SCK
SCL: J9.2 R5.1 U1.43(PD0/SCL/INT0) ; port SCL
SDA: J9.3 R4.1 U1.44(PD1/SDA/INT1) ; port SDA
SS: U1.19(PB0/~{SS}/PCINT0) ; port ~{SS}
TXD0: J5.3 U1.3(PE1/TXD0) ; port TXD0
TXD1: J6.3 U1.46(PD3/TXD1/INT3) ; port TXD1
TXD2: J7.3 U1.13(PH1/TXD2) ; port TXD2
TXD3: J8.3 U1.64(PJ1/TXD3/PCINT10) ; port TXD3
XTAL1: C7.2 U1.34(XTAL1) Y1.1
XTAL2: C8.2 U1.33(XTAL2) Y1.3
NetJ3_2: J3.2 R3.1
NetU1_14: U1.14(PH2/XCK2) ; port PH2
NetU1_18: U1.18(PH6/OC2B) ; port PH6
NetU1_65: U1.65(PJ2/XCK3/PCINT11) ; port PJ2
NetU1_69: U1.69(PJ6/PCINT15) ; port PJ6
NetU1_79: U1.79(PJ7) ; port PJ7

Not connected (* = marked no-connect by the designer): U1 1(PG5/OC0B) 4(PE2/XCK0/AIN0) 5(PE3/OC3A/AIN1) 6(PE4/OC3B/INT4) 7(PE5/OC3C/INT5) 8(PE6/T3/INT6) 9(PE7/CLKO/ICP3/INT7) 27(PH7/T4) 28(PG3/TOSC2) 29(PG4/TOSC1) 47(PD4/ICP1) 48(PD5/XCK1) 49(PD6/T1) 50(PD7/T0) 51(PG0/~{WR}) 52(PG1/~{RD}) 53(PC0/A8) 54(PC1/A9) 55(PC2/A10) 56(PC3/A11) 57(PC4/A12) 58(PC5/A13) 59(PC6/A14) 60(PC7/A15) 70(PG2/ALE) 71(PA7/AD7)* 72(PA6/AD6)* 73(PA5/AD5)* 74(PA4/AD4)* 75(PA3/AD3)* 76(PA2/AD2)* 77(PA1/AD1)* 78(PA0/AD0)* 98(AREF)

### Library data of the parts
C1-C6 = 0805 Capacitor
C7 C8 = 0603 Capacitor
J4 = 6-Pin Data Connector: CONN HEADER VERT 6POS .100 TIN; Manufacturer 1: TE Connectivity; Manufacturer Part Number 1: 2-644861-6; Underplate Material: Nickel; Number of Contacts: 6; Connector Type: Plug,Header,Pin; Contact Resistance: 6mR; Mating Alignment: Yes (With); PCB Mount Retention: Without; PCB Mounting Orientation: Vertical; Parameter Name 1: Box; Voltage Rating: 250V; Current Rating: 5A; Backwall/Post Interruptions: No (Without); Connector System: Wire-to-Board; Plating Thickness: 6.3um; Contact Style: Straight; Contact Post Length: 3.56mm; PCB Thickness: 0.063inch; Approvals: CSA; Supplier 1: Digi-Key; Stock 1: 208; Pricing 1: 1=1.04000, 10=0.91900, 100=0.79250, 500=0.64840, 1000=0.57635, 5000=0.50431, 10000=0.47909 (USD); RoHS: Yes; Mount: Through Hole; Housing Material: Polyester; Contact Plating: Tin,Matte; Contact Material: Copper Alloy; Contact Shape: Square; Color: Black; Housing Color: Black; Min Operating Temperature: -67°C; Max Operating Temperature: 221°C; Number of Rows: 1; Termination: Solder; Contact Gender: Male; Package Quantity: 1000; Max Voltage Rating (AC): 250V; Fastening Type: Friction; Orientation: Straight; Number of Positions: 6; Contact Retention: No (Without); Mating Retention: Yes (With); PCB Mount Alignment: No (Without); Sealable: No (Without); Strain Relief: No (Without); Contact Current Rating: 5A; Length: 0.684inch; Height: 10.41mm; Pitch: 2.54mm; Contact Mating Length: 5.1mm; Depth: 7.95mm; Tail Length: 3.56mm; Radiation Hardening: No; Flammability Rating: UL94 V-0; REACH SVHC: Unknown; ComponentLink1URL: https://datasheet.ciiva.com/30493/0900766b80f915a1-30493314.pdf?src-supplier=RSComponents; ComponentLink1Description: https://datasheet.ciiva.com/30493/0900766b80f915a1-30493314.pdf?src-supplier=RSComponents; ComponentLink2URL: https://datasheet.ciiva.com/16303/2-644861-6-16303636.pdf?src-supplier=Future+Electronics; ComponentLink2Description: https://datasheet.ciiva.com/16303/2-644861-6-16303636.pdf?src-supplier=Future+Electronics; ComponentLink3URL: https://datasheet.ciiva.com/16684/eng-ds-82056-mta-0608-16684438.pdf?src-supplier=Avnet+Europe; ComponentLink3Description: https://datasheet.ciiva.com/16684/eng-ds-82056-mta-0608-16684438.pdf?src-supplier=Avnet+Europe; ComponentLink4URL: https://datasheet.ciiva.com/15175/getdatasheetpartid-36761-15175467.pdf?src-supplier=Verical; ComponentLink4Description: https://datasheet.ciiva.com/15175/getdatasheetpartid-36761-15175467.pdf?src-supplier=Verical; ComponentLink5URL: https://datasheet.ciiva.com/714/eng-cd-644861-n-basefilename-714750.pdf?src-supplier=Digi-Key; ComponentLink5Description: https://datasheet.ciiva.com/714/eng-cd-644861-n-basefilename-714750.pdf?src-supplier=Digi-Key; ComponentLink6URL: https://datasheet.ciiva.com/30135/8852eng-ds-82056-mta-0608-30135278.pdf?src-supplier=Onlinecomponents.com; ComponentLink6Description: https://datasheet.ciiva.com/30135/8852eng-ds-82056-mta-0608-30135278.pdf?src-supplier=Onlinecomponents.com; ComponentLink7URL: https://datasheet.ciiva.com/3118/eng-ds-82056-mta-0608-3118127.pdf?src-supplier=Avnet; ComponentLink7Description: https://datasheet.ciiva.com/3118/eng-ds-82056-mta-0608-3118127.pdf?src-supplier=Avnet; Supplier Part Number 1: A30935-ND
J5-J9 = 4-Pin Data Connector: as J15 on sheet ESP; Supplier 1: Digi-Key; Stock 1: 18767; Pricing 1: 1=0.79000, 10=0.74100, 100=0.56790, 500=0.49380, 1000=0.40739, 5000=0.35801, 10000=0.33332 (USD); RoHS: Yes; Mount: Through Hole; Housing Color: Black; Color: Black; Contact Material: Copper Alloy; Contact Plating: Tin,Matte; Housing Material: Polyester; Contact Shape: Square; Min Operating Temperature: -67°C; Max Operating Temperature: 221°C; Termination: Solder; Number of Rows: 1; Contact Gender: Male; Number of Positions: 4; Package Quantity: 500; Packaging: Loose Piece; Current Rating: 5A; Voltage Rating (AC): 250V; Mating Alignment: Yes (With); Orientation: Straight; Fastening Type: Friction; Max Voltage Rating (AC): 250V; Contact Current Rating: 5A; Contact Retention: No (Without); Mating Retention: Yes (With); PCB Mount Alignment: No (Without); Sealable: No (Without); Strain Relief: No (Without); Contact Style: Straight; Length: 12.29mm; Height: 10.41mm; Pitch: 2.54mm; Contact Mating Length: 5.1mm; Depth: 7.95mm; Tail Length: 3.56mm; Radiation Hardening: No; Flammability Rating: UL94 V-0; ELV: Compliant; Lead Free: Lead Free; REACH SVHC: Unknown; ComponentLink1URL: https://datasheet.ciiva.com/7800/1651878-7800290.pdf?src-supplier=Element14; ComponentLink1Description: https://datasheet.ciiva.com/7800/1651878-7800290.pdf?src-supplier=Element14; ComponentLink2URL: https://datasheet.ciiva.com/15175/getdatasheetpartid-36841-15175492.pdf?src-supplier=Verical; ComponentLink2Description: https://datasheet.ciiva.com/15175/getdatasheetpartid-36841-15175492.pdf?src-supplier=Verical; ComponentLink3URL: https://datasheet.ciiva.com/11759/0900766b80f915a0-11759930.pdf?src-supplier=RSComponents; ComponentLink3Description: https://datasheet.ciiva.com/11759/0900766b80f915a0-11759930.pdf?src-supplier=RSComponents; ComponentLink4URL: https://datasheet.ciiva.com/714/eng-cd-644861-n-basefilename-714593.pdf?src-supplier=Digi-Key; ComponentLink4Description: https://datasheet.ciiva.com/714/eng-cd-644861-n-basefilename-714593.pdf?src-supplier=Digi-Key; ComponentLink5URL: https://datasheet.ciiva.com/16684/eng-ds-82056-mta-0608-16684709.pdf?src-supplier=Avnet+Europe; ComponentLink5Description: https://datasheet.ciiva.com/16684/eng-ds-82056-mta-0608-16684709.pdf?src-supplier=Avnet+Europe; ComponentLink6URL: https://datasheet.ciiva.com/16497/eng-ds-82056-mta-0608-16497871.pdf?src-supplier=Avnet+Asia; ComponentLink6Description: https://datasheet.ciiva.com/16497/eng-ds-82056-mta-0608-16497871.pdf?src-supplier=Avnet+Asia; Supplier Part Number 1: A30933-ND
R3-R5 = 0603 Resistor
U1 = ATmega2560-16AU: MP: ATmega2560-16AU; Package: None; Price: None; Value: *; Availability: Unavailable
Y1 = 3225_Crystal

## Sheet Power.SchDoc
size A; SheetNumber: 5; SheetTotal: 8
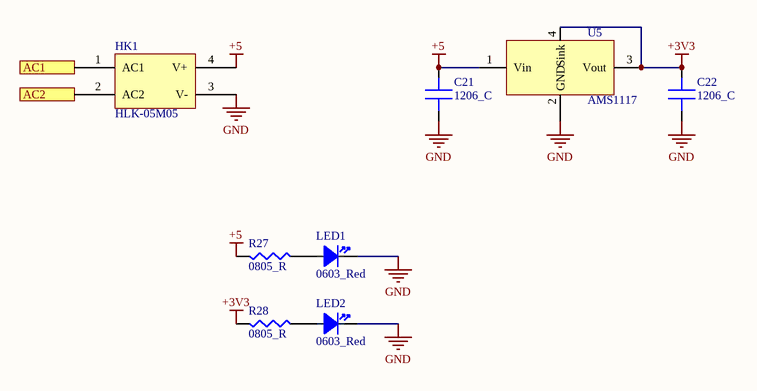
[diagram p5: Power.SchDoc]

### Parts
C21  1206_C  [1206]
C22  1206_C  [1206]
HK1  HLK-05M05  [HLK-05M05]
LED1  0603_Red  [0603_LED]
LED2  0603_Red  [0603_LED]
R27  0805_R  [R0805]
R28  0805_R  [R0805]
U5  AMS1117  [SOT-223]

### Ports
AC1 (in), AC2 (in)

### Nets
+3V3: C22.2 R28.1 U5.3(Vout) U5.4(Sink)
+5: C21.2 HK1.4(V+) R27.1 U5.1(Vin)  [project net ~{RST}]
GND: C21.1 C22.1 HK1.3(V-) LED1.2(Cathode) LED2.2(Cathode) U5.2(GND)
MAINS_L1: HK1.2(AC2) ; port AC2
MAINS_N: HK1.1(AC1) ; port AC1
NetLED1_1: LED1.1(Anode) R27.2
NetLED2_1: LED2.1(Anode) R28.2

### Library data of the parts
C21 C22 = 1206 Capacitor
LED1 LED2 = 0603LED
R27 R28 = 0805 Resistor
U5 = AMS1117 - 3V3: AMS1117-3.3 Checked Fixed Positive LDO Regulator, 3.3V, 1.3V Dropout, PDSO3 Voltage Regulators - Linear

## Sheet Temperature Sensor.SchDoc
size A; SheetNumber: 7; SheetTotal: 8
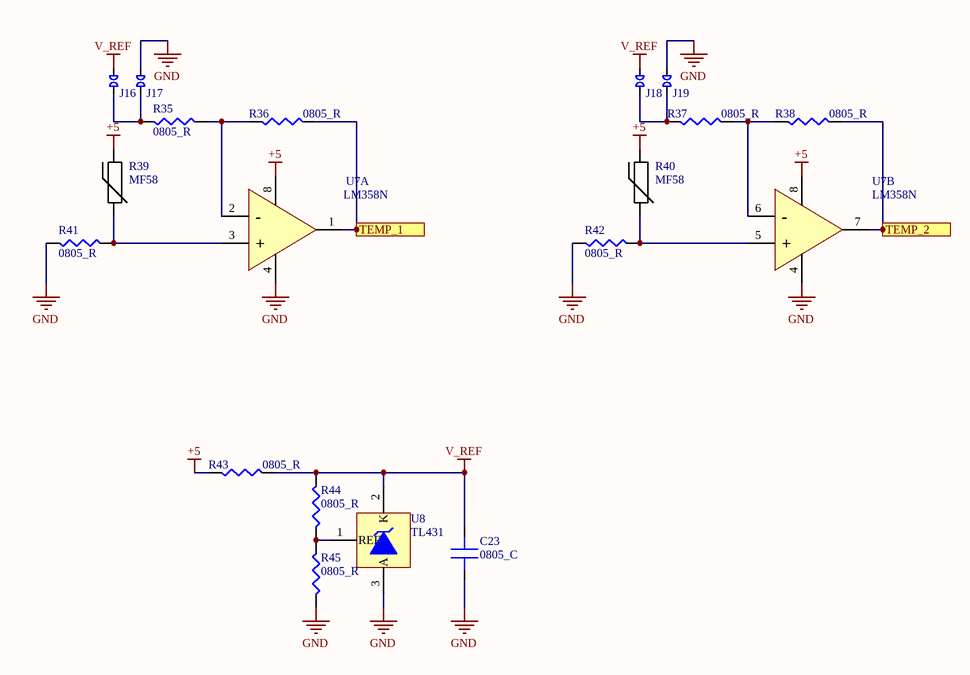
[diagram p6: Temperature Sensor.SchDoc]

### Parts
C23  0805_C  [C0805 - 0.1uf]
J16  Jumper Pads  [JMP]  (value not drawn)
J17  Jumper Pads  [JMP]  (value not drawn)
J18  Jumper Pads  [JMP]  (value not drawn)
J19  Jumper Pads  [JMP]  (value not drawn)
R35  0805_R  [R0805]
R36  0805_R  [R0805]
R37  0805_R  [R0805]
R38  0805_R  [R0805]
R39  MF58  [NTC 3mm]
R40  MF58  [NTC 3mm]
R41  0805_R  [R0805]
R42  0805_R  [R0805]
R43  0805_R  [R0805]
R44  0805_R  [R0805]
R45  0805_R  [R0805]
U7  LM358N  [SOP8]  (parts A,B of 2)
U8  TL431  [SO-23]

### Ports
TEMP_1 (out), TEMP_2 (out)

### Nets
+5: R39.2 R40.2 R43.2 U7.8(VCC)  [project net ~{RST}]
GND: C23.1 J17.2 J19.2 R41.1 R42.1 R45.2 U7.4(VSS) U8.3(A)
V_REF: C23.2 J16.2 J18.2 R43.1 R44.1 U8.2(K)
ADC8: R36.1 U7.1(OUT1) ; port TEMP_1
ADC9: R38.1 U7.7(OUT1) ; port TEMP_2
NetJ16_1: J16.1 J17.1 R35.1
NetJ18_1: J18.1 J19.1 R37.2
NetR35_2: R35.2 R36.2 U7.2(-)
NetR37_1: R37.1 R38.2 U7.6(-)
NetR39_1: R39.1 R41.2 U7.3(+)
NetR40_1: R40.1 R42.2 U7.5(+)
NetR44_2: R44.2 R45.1 U8.1(REF)

### Library data of the parts
C23 = 0805 Capacitor
R35-R38 R41-R45 = 0805 Resistor
R39 R40 = MF58: NTC 100K THERMISTOR MF58
U8 = TL431: SMD Voltage References SOT-23

## Sheet Voltage_Current_Schem.SchDoc
size A; SheetNumber: 3; SheetTotal: 8
Used 3 times, as channels U_Voltage_Current_Schem1, U_Voltage_Current_Schem2, U_Voltage_Current_Schem3. Parts and nets are listed once, with the designators drawn on the sheet.
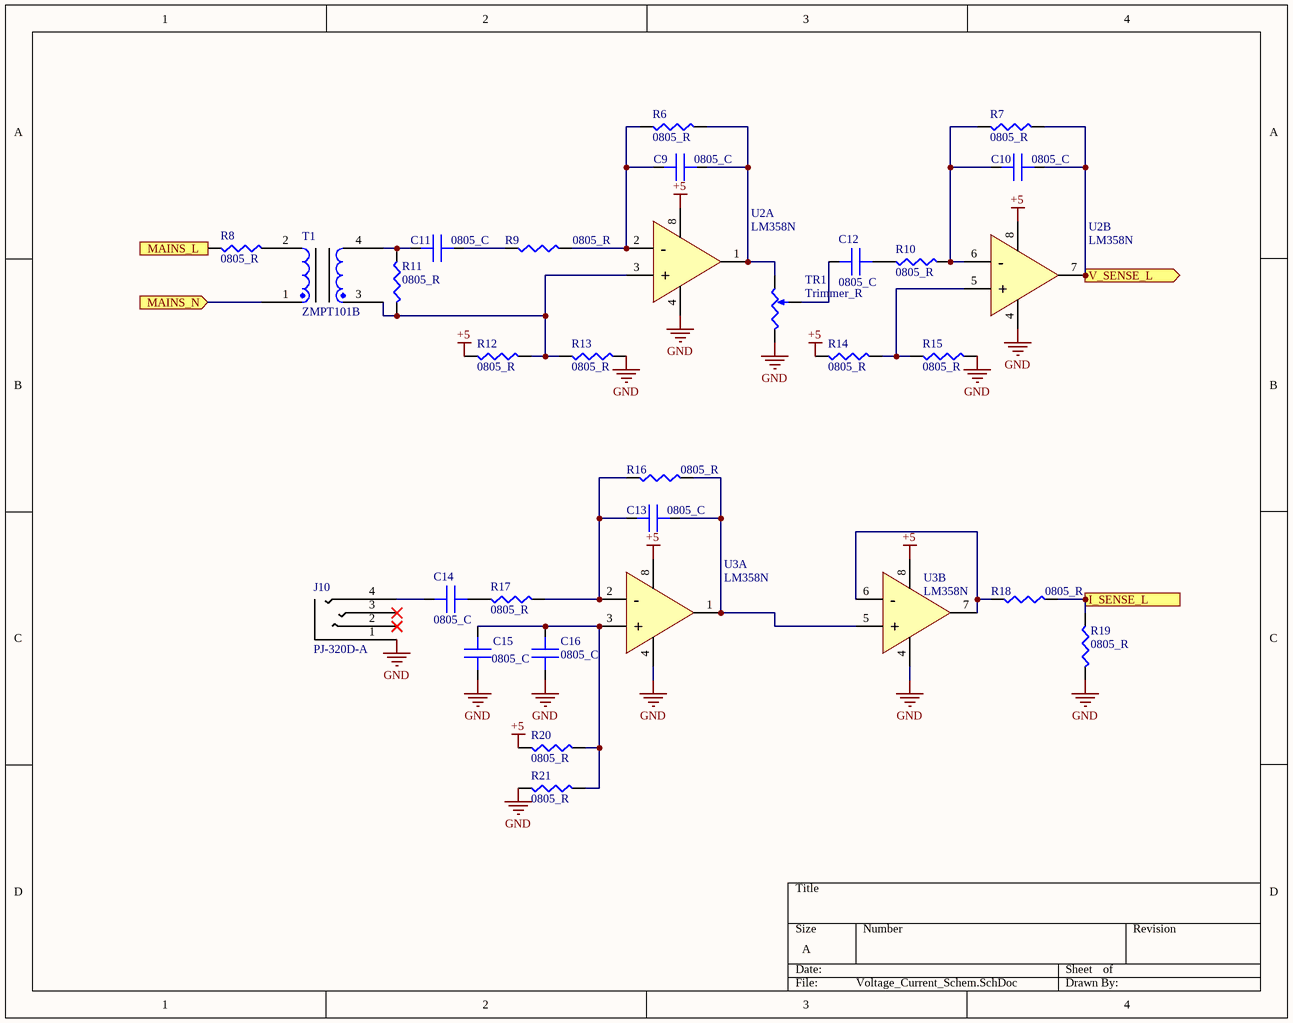
[diagram p7: Voltage_Current_Schem.SchDoc]

### Parts
C9  0805_C  [C0805 - 0.1uf]
C10  0805_C  [C0805 - 0.1uf]
C11  0805_C  [C0805 - 0.1uf]
C12  0805_C  [C0805 - 0.1uf]
C13  0805_C  [C0805 - 0.1uf]
C14  0805_C  [C0805 - 0.1uf]
C15  0805_C  [C0805 - 0.1uf]
C16  0805_C  [C0805 - 0.1uf]
J10  PJ-320D-A  [PJ-320D-A]
R6  0805_R  [R0805]
R7  0805_R  [R0805]
R8  0805_R  [R0805]
R9  0805_R  [R0805]
R10  0805_R  [R0805]
R11  0805_R  [R0805]
R12  0805_R  [R0805]
R13  0805_R  [R0805]
R14  0805_R  [R0805]
R15  0805_R  [R0805]
R16  0805_R  [R0805]
R17  0805_R  [R0805]
R18  0805_R  [R0805]
R19  0805_R  [R0805]
R20  0805_R  [R0805]
R21  0805_R  [R0805]
T1  ZMPT101B  [ZMPT101B]
TR1  Trimmer_R  [3296W_TRIMMER]
U2  LM358N  [SOP8]  (parts A,B of 2)
U3  LM358N  [SOP8]  (parts A,B of 2)

### Ports
I_SENSE_L (out), MAINS_L (in), MAINS_N (in), V_SENSE_L (out)

### Nets
+5: R12.1 R14.1 R20.2 U2.8(VCC) U3.8(VCC)
GND: C15.1 C16.1 J10.1 R13.2 R15.2 R19.2 R21.2 TR1.2 U2.4(VSS) U3.4(VSS)
I_SENSE_L: R18.1 R19.1 ; port I_SENSE_L
MAINS_L: R8.1 ; port MAINS_L
MAINS_N: T1.1 ; port MAINS_N
V_SENSE_L: C10.2 R7.2 U2.7(OUT1) ; port V_SENSE_L
NetC9_1: C9.1 R6.1 R9.2 U2.2(-)
NetC9_2: C9.2 R6.2 TR1.1 U2.1(OUT1)
NetC10_1: C10.1 R7.1 R10.2 U2.6(-)
NetC11_1: C11.1 R11.2 T1.4
NetC11_2: C11.2 R9.1
NetC12_1: C12.1 TR1.3
NetC12_2: C12.2 R10.1
NetC13_1: C13.1 R16.1 R17.1 U3.2(-)
NetC13_2: C13.2 R16.2 U3.1(OUT1) U3.5(+)
NetC14_1: C14.1 J10.4
NetC14_2: C14.2 R17.2
NetC15_2: C15.2 C16.2 R20.1 R21.1 U3.3(+)
NetR8_2: R8.2 T1.2
NetR11_1: R11.1 R12.2 R13.1 T1.3 U2.3(+)
NetR14_2: R14.2 R15.1 U2.5(+)
NetR18_2: R18.2 U3.6(-) U3.7(OUT1)

Not connected (* = marked no-connect by the designer): J10 2* 3*

### Channels
U_Voltage_Current_Schem1: designators end in A; ports I_SENSE_L=ADC3 MAINS_L=MAINS_L1 MAINS_N=MAINS_N V_SENSE_L=ADC0
U_Voltage_Current_Schem2: designators end in B; ports I_SENSE_L=ADC4 MAINS_L=MAINS_L2 MAINS_N=MAINS_N V_SENSE_L=ADC1
U_Voltage_Current_Schem3: designators end in C; ports I_SENSE_L=ADC5 MAINS_L=MAINS_L3 MAINS_N=MAINS_N V_SENSE_L=ADC2

### Library data of the parts
C9-C16 = 0805 Capacitor
R6-R21 = 0805 Resistor
TR1 = Blue Trimmer Pot (Small)

## Nets that join several sheets
+3V3: Control_Pilot_Schem (R22.2), ESP (6 pins), Power (C22.2 R28.1 U5.3 U5.4)
GND: EV_Schematics (R2.1), Control_Pilot_Schem (10 pins), ESP (8 pins), Fan_Relay (12 pins), MCU (22 pins), Power (6 pins), Temperature Sensor (8 pins), U_Voltage_Current_Schem1 (10 pins), U_Voltage_Current_Schem2 (10 pins), U_Voltage_Current_Schem3 (10 pins)
~{RST}: EV_Schematics (R1.2), Control_Pilot_Schem (C17.2 L1.1), ESP (Q4.D), Fan_Relay (12 pins), MCU (24 pins), Power (C21.2 HK1.4 R27.1 U5.1), Temperature Sensor (R39.2 R40.2 R43.2 U7.8), U_Voltage_Current_Schem1 (5 pins), U_Voltage_Current_Schem2 (5 pins), U_Voltage_Current_Schem3 (5 pins)
ADC0: MCU (U1.97), U_Voltage_Current_Schem1 (C10A.2 R7A.2 U2A.7)
ADC1: MCU (U1.96), U_Voltage_Current_Schem2 (C10B.2 R7B.2 U2B.7)
ADC2: MCU (U1.95), U_Voltage_Current_Schem3 (C10C.2 R7C.2 U2C.7)
ADC3: MCU (U1.94), U_Voltage_Current_Schem1 (R18A.1 R19A.1)
ADC4: MCU (U1.93), U_Voltage_Current_Schem2 (R18B.1 R19B.1)
ADC5: MCU (U1.92), U_Voltage_Current_Schem3 (R18C.1 R19C.1)
ADC6: Control_Pilot_Schem (R25.1 R26.2), MCU (U1.91)
ADC7: EV_Schematics (J2.2 R1.1 R2.2), MCU (U1.90)
ADC8: MCU (U1.89), Temperature Sensor (R36.1 U7.1)
ADC9: MCU (U1.88), Temperature Sensor (R38.1 U7.7)
CP: EV_Schematics (J2.1), Control_Pilot_Schem (D1.A D2.K R23.1)
MAINS_L1: EV_Schematics (J1.2), Power (HK1.2), U_Voltage_Current_Schem1 (R8A.1)
MAINS_L2: EV_Schematics (J1.3), U_Voltage_Current_Schem2 (R8B.1)
MAINS_L3: EV_Schematics (J1.4), U_Voltage_Current_Schem3 (R8C.1)
MAINS_N: EV_Schematics (J1.1), Power (HK1.1), U_Voltage_Current_Schem1 (T1A.1), U_Voltage_Current_Schem2 (T1B.1), U_Voltage_Current_Schem3 (T1C.1)
PB4: Fan_Relay (J24.3), MCU (U1.23)
PB5: Fan_Relay (J24.4), MCU (U1.24)
PB6: Fan_Relay (J25.3), MCU (U1.25)
PB7: Fan_Relay (J25.4), MCU (U1.26)
PH3: Fan_Relay (R47.1), MCU (U1.15)
PH4: Fan_Relay (R46.1), MCU (U1.16)
PH5: Fan_Relay (R56.1), MCU (U1.17)
PJ3: Fan_Relay (R54.2), MCU (U1.66)
PJ4: Fan_Relay (R52.2), MCU (U1.67)
PJ5: Fan_Relay (R50.2), MCU (U1.68)
PL0: Fan_Relay (J26.3), MCU (U1.35)
PL1: Fan_Relay (J26.4), MCU (U1.36)
RXD0: ESP (J11.1 J13.2), MCU (J5.2 U1.2)
TXD0: ESP (J12.1 J14.2), MCU (J5.3 U1.3)